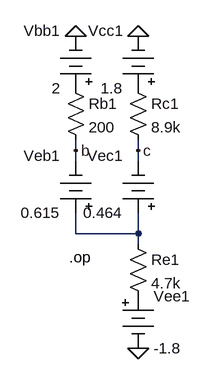
[diagram p0: schematic 24-5-7-a-1.asc]
24-5-7-a-1.asc, the LTspice schematic file:
Version 4
SHEET 1 880 680
WIRE 128 96 128 80
WIRE 224 96 224 80
WIRE 128 112 128 96
WIRE 224 112 224 96
WIRE 128 224 128 192
WIRE 224 224 224 192
WIRE 224 224 128 224
WIRE 224 240 224 224
FLAG 224 -80 0
FLAG 128 -80 0
FLAG 128 96 b
FLAG 224 96 c
FLAG 224 400 0
SYMBOL Misc\\battery 128 208 R180
WINDOW 0 24 104 Left 2
WINDOW 3 24 16 Left 2
WINDOW 123 0 0 Left 0
WINDOW 39 0 0 Left 0
SYMATTR InstName Veb1
SYMATTR Value 0.615
SYMBOL Misc\\battery 224 208 R180
WINDOW 0 24 104 Left 2
WINDOW 3 24 16 Left 2
WINDOW 123 0 0 Left 0
WINDOW 39 0 0 Left 0
SYMATTR InstName Vec1
SYMATTR Value 0.464
SYMBOL Misc\\battery 128 16 R180
WINDOW 0 24 104 Left 2
WINDOW 3 24 16 Left 2
WINDOW 123 0 0 Left 0
WINDOW 39 0 0 Left 0
SYMATTR InstName Vbb1
SYMATTR Value 2
SYMBOL Misc\\battery 224 16 R180
WINDOW 0 24 104 Left 2
WINDOW 3 24 16 Left 2
WINDOW 123 0 0 Left 0
WINDOW 39 0 0 Left 0
SYMATTR InstName Vcc1
SYMATTR Value 1.8
SYMBOL Misc\\battery 224 304 R0
WINDOW 123 0 0 Left 0
WINDOW 39 0 0 Left 0
SYMATTR InstName Vee1
SYMATTR Value -1.8
SYMBOL res 112 -16 R0
SYMATTR InstName Rb1
SYMATTR Value 200
SYMBOL res 208 -16 R0
SYMATTR InstName Rc1
SYMATTR Value 8.9k
SYMBOL res 208 224 R0
SYMATTR InstName Re1
SYMATTR Value 4.7k
TEXT 118 260 Left 2 !.op

The netlist it stands for:
* 24-5-7-a-1.asc
Veb1 N001 b 0.615
Vec1 N001 c 0.464
Vbb1 P001 0 2
Vcc1 P002 0 1.8
Vee1 P003 0 -1.8
Rb1 P001 b 200
Rc1 P002 c 8.9k
Re1 N001 P003 4.7k
.op
.backanno
.end